# EAGLE design Grove - Themocouple Amplifier (MAX31850K) (EAGLE 6.4)

## Sheet 1 of 2
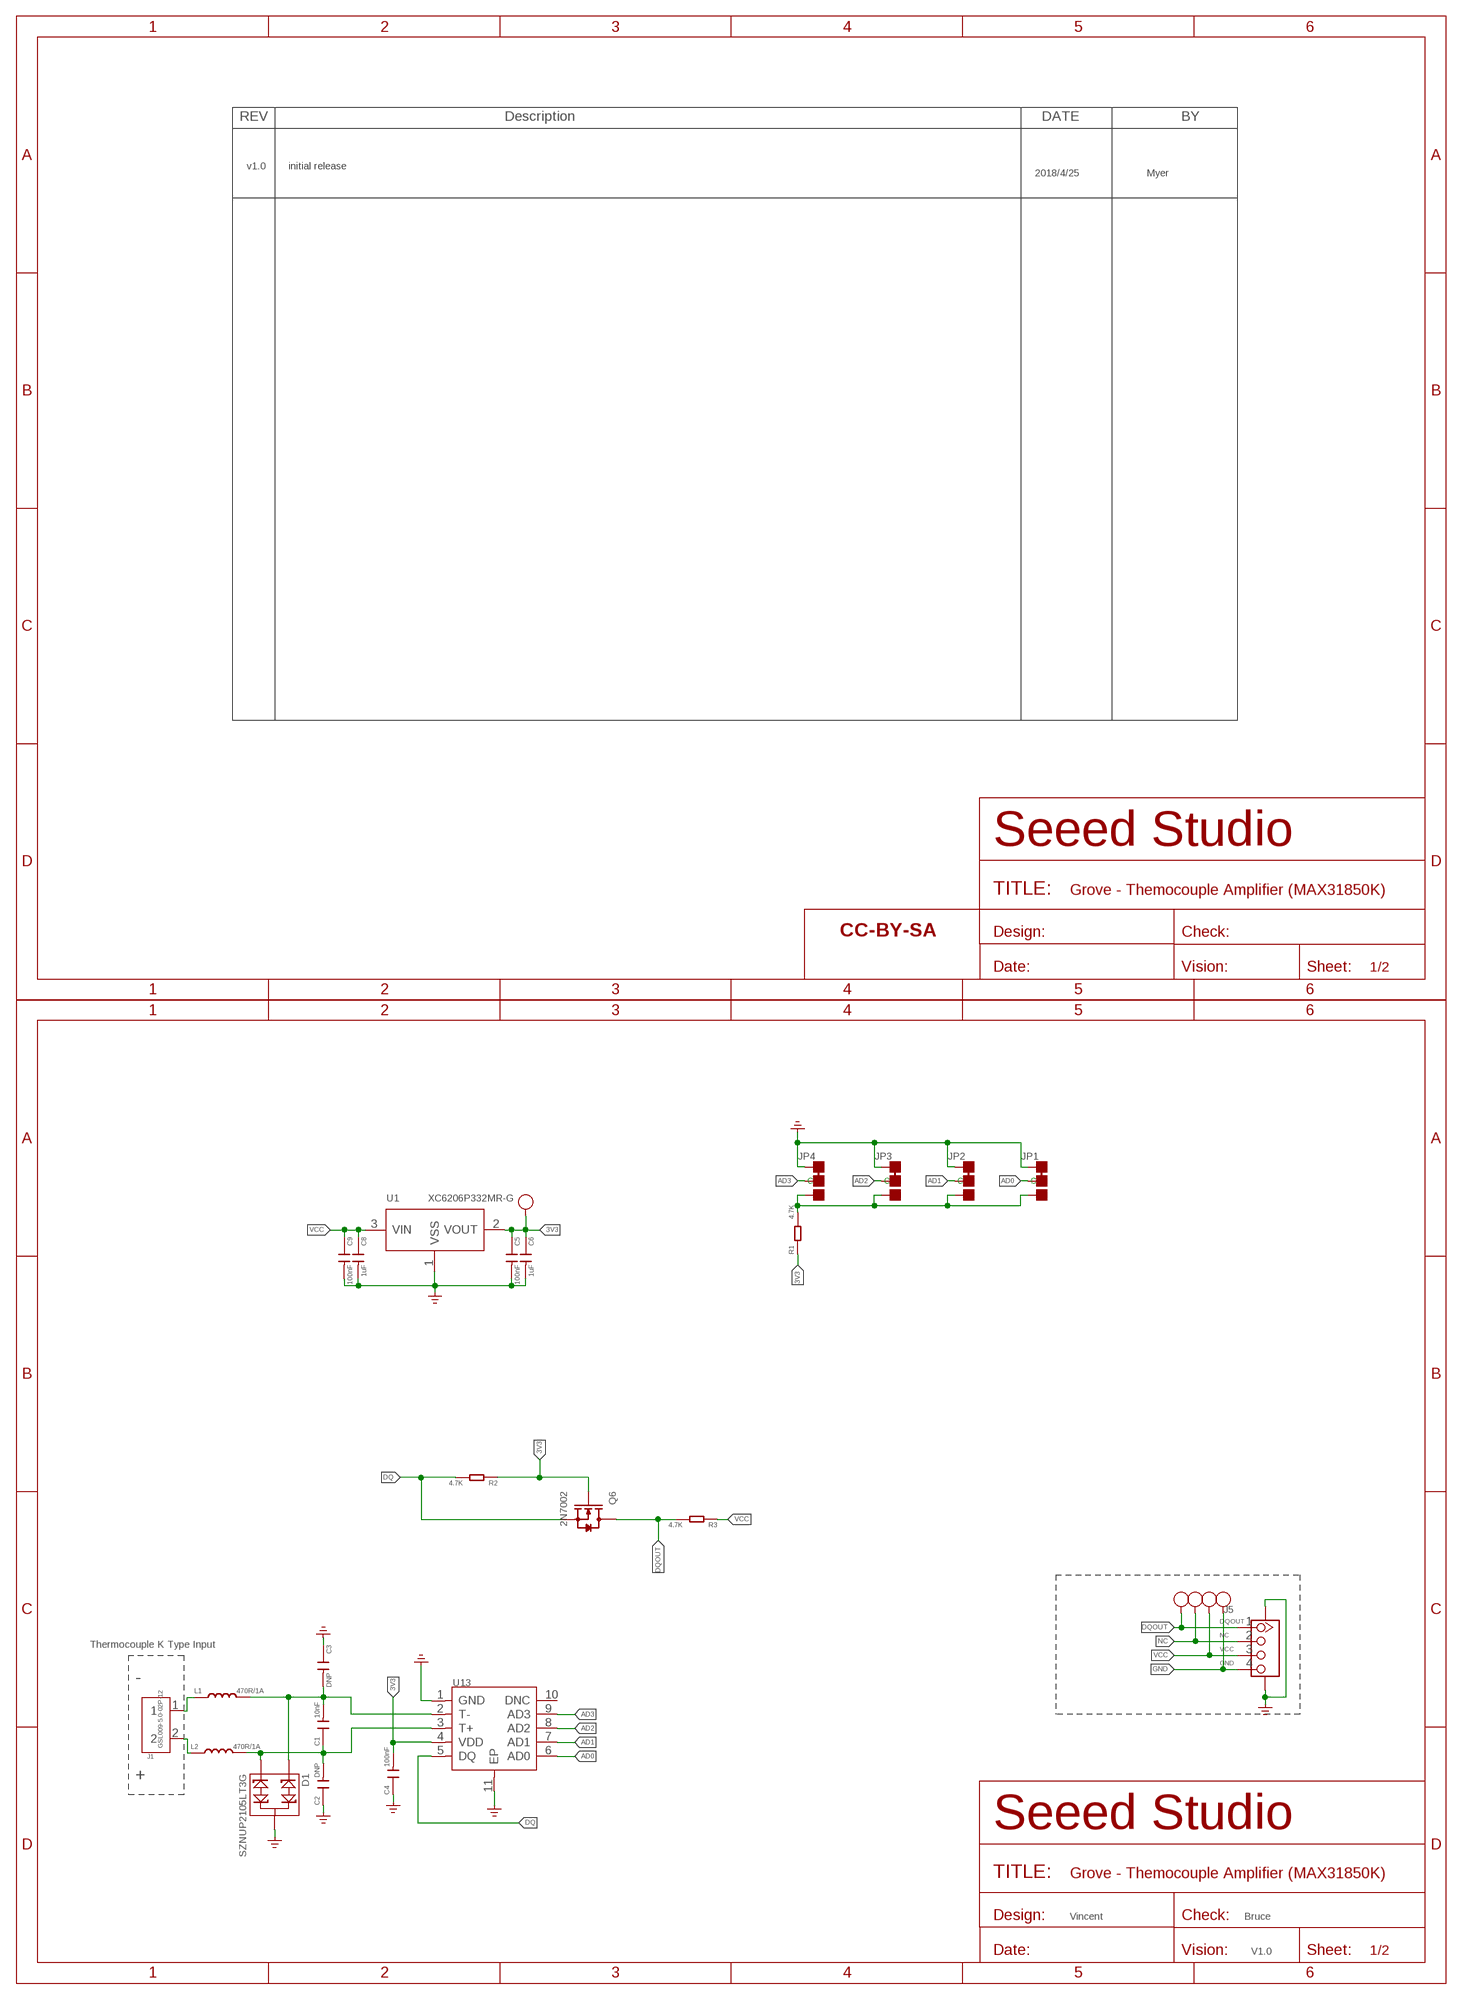
[diagram p0: schematic, sheet 1]

### Parts
C1  10nF  C-0805  [C0805]
C2  DNP  C-0603  [C0603]
C3  DNP  C-0603  [C0603]
C4  100nF  C-0603  [C0603]
C5  100nF  C-0603  [C0603]
C6  1uF  C-0603  [C0603]
C8  1uF  C-0603  [C0603]
C9  100nF  C-0603  [C0603]
D1  SZNUP2105LT3G  D-TVS-3P'PESD5V0L2BT'  [SOT-23]
FR2  SEEEDSTUDIO-OPEN-SCH-FRAME  [SEEEDSTUDIO-PCB-FRAME]
GND4  TEST-POINT'4545'  [TP-D45MIL]
J1  GSL009-5.0-02P-12  SCREW-TERMINAL-2P'5.0-10.6X10X14.8H'  [2P-5.0-10.6X10X14.8H]
J5  GROVE-CONNECTOR-SMD'90D'  [HW4-SMD-2.0-90D]
JP1  JP-3P-SHORT  [3P-SMD-SHORT]
JP2  JP-3P-SHORT  [3P-SMD-SHORT]
JP3  JP-3P-SHORT  [3P-SMD-SHORT]
JP4  JP-3P-SHORT  [3P-SMD-SHORT]
L1  470R/1A  L-0603  [L0603]
L2  470R/1A  L-0603  [L0603]
Q6  2N7002  MOSFET-N+'SI1304BDL'  [SOT-323]
R1  4.7K  R-0603  [R0603]
R2  4.7K  R-0603  [R0603]
R3  4.7K  R-0603  [R0603]
SCL  TEST-POINT'4545'  [TP-D45MIL]
SDA3  TEST-POINT'4545'  [TP-D45MIL]
SDA4  TEST-POINT'4545'  [TP-D45MIL]
U1  XC6206P332MR-G  PMIC-XC6206PMR  [SOT-23]
U13  CONVERTER-MAX31850  [TDFN10-0.5-3X4MM]
VCC1  TEST-POINT'4545'  [TP-D45MIL]

### Nets
3V3: C4.2 C5.1 C6.1 Q6.1(G) R1.1 R2.1 SDA3.T U1.2(VOUT) U13.4(VDD)
AD0: JP1.MM(C) U13.6(AD0)
AD1: JP2.MM(C) U13.7(AD1)
AD2: JP3.MM(C) U13.8(AD2)
AD3: JP4.MM(C) U13.9(AD3)
DQ: Q6.2(S) R2.2 U13.5(DQ)
DQOUT: GND4.T J5.1 Q6.3(D) R3.2
GND: C2.1 C3.1 C4.1 C5.2 C6.2 C8.2 C9.2 D1.3 J5.4 J5.SS1 J5.SS2 JP1.11(L) JP2.11(L) JP3.11(L) JP4.11(L) SCL.T U1.1(VSS) U13.1(GND) U13.11(EP) ; supply symbol labelled GND_POWER
N$1: J1.1 L1.1
N$2: J1.2 L2.1
N$6: JP1.00(R) JP2.00(R) JP3.00(R) JP4.00(R) R1.2
N$8: C1.2 C3.2 D1.1 L1.2 U13.2(T-)
N$9: C1.1 C2.2 D1.2 L2.2 U13.3(T+)
NC: J5.2 VCC1.T
VCC: C8.1 C9.1 J5.3 R3.1 SDA4.T U1.3(VIN)
Unconnected: U13.10(DNC)

### Notes on the sheet
- v1.0 | initial release
- 2018/4/25 | Myer
- Thermocouple K Type Input
- -
- +
- Vincent | Bruce
- V1.0

## Sheet 2 of 2
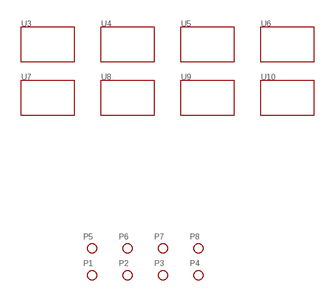
[diagram p1: schematic, sheet 2]

### Parts
P1  PAD-MARK  [ROUND-MARK-1.0]
P2  PAD-MARK  [ROUND-MARK-1.0]
P3  PAD-MARK  [ROUND-MARK-1.0]
P4  PAD-MARK  [ROUND-MARK-1.0]
P5  PAD-MARK  [ROUND-MARK-1.0]
P6  PAD-MARK  [ROUND-MARK-1.0]
P7  PAD-MARK  [ROUND-MARK-1.0]
P8  PAD-MARK  [ROUND-MARK-1.0]
U3  TWIG'2U'  [GROVE-TEST-PLATFORM]
U4  TWIG'2U'  [GROVE-TEST-PLATFORM]
U5  TWIG'2U'  [GROVE-TEST-PLATFORM]
U6  TWIG'2U'  [GROVE-TEST-PLATFORM]
U7  TWIG'2U'  [GROVE-TEST-PLATFORM]
U8  TWIG'2U'  [GROVE-TEST-PLATFORM]
U9  TWIG'2U'  [GROVE-TEST-PLATFORM]
U10  TWIG'2U'  [GROVE-TEST-PLATFORM]

## Library data of the parts
C1-C6 C8 C9 = Discrete-small:C*: Ceramic Capacitors
D1 = Discrete-new:D-TVS-3P: 304050001
FR2 = moudle-new:SEEEDSTUDIO-OPEN-SCH-FRAME
GND4 SCL SDA3 SDA4 VCC1 = Discrete-new:TEST-POINT; PARTNO: DNP
J1 = Connector:SCREW-TERMINAL-2P
J5 = Connector-new:GROVE-CONNECTOR-SMD: 4P-SMD-2.0:320110030;4P-SMD-2.0-90D:320110032
JP1-JP4 = Discrete-new:JP-3P-SHORT
L1 L2 = Discrete-small:L
P1-P8 = Discrete:PAD-MARK; PARTNO: DNP
Q6 = Discrete-new:MOSFET-N+: IRLL014: http://www.vishay.com/docs/91319/sihll014.pdf
R1-R3 = Discrete-small:R*
U1 = IC-new:PMIC-XC6206P: LOW ESR Cap.Compatible Positive Voltage Regulators
U3-U10 = template:TWIG
U13 = IC-new:CONVERTER-MAX31850

## Board
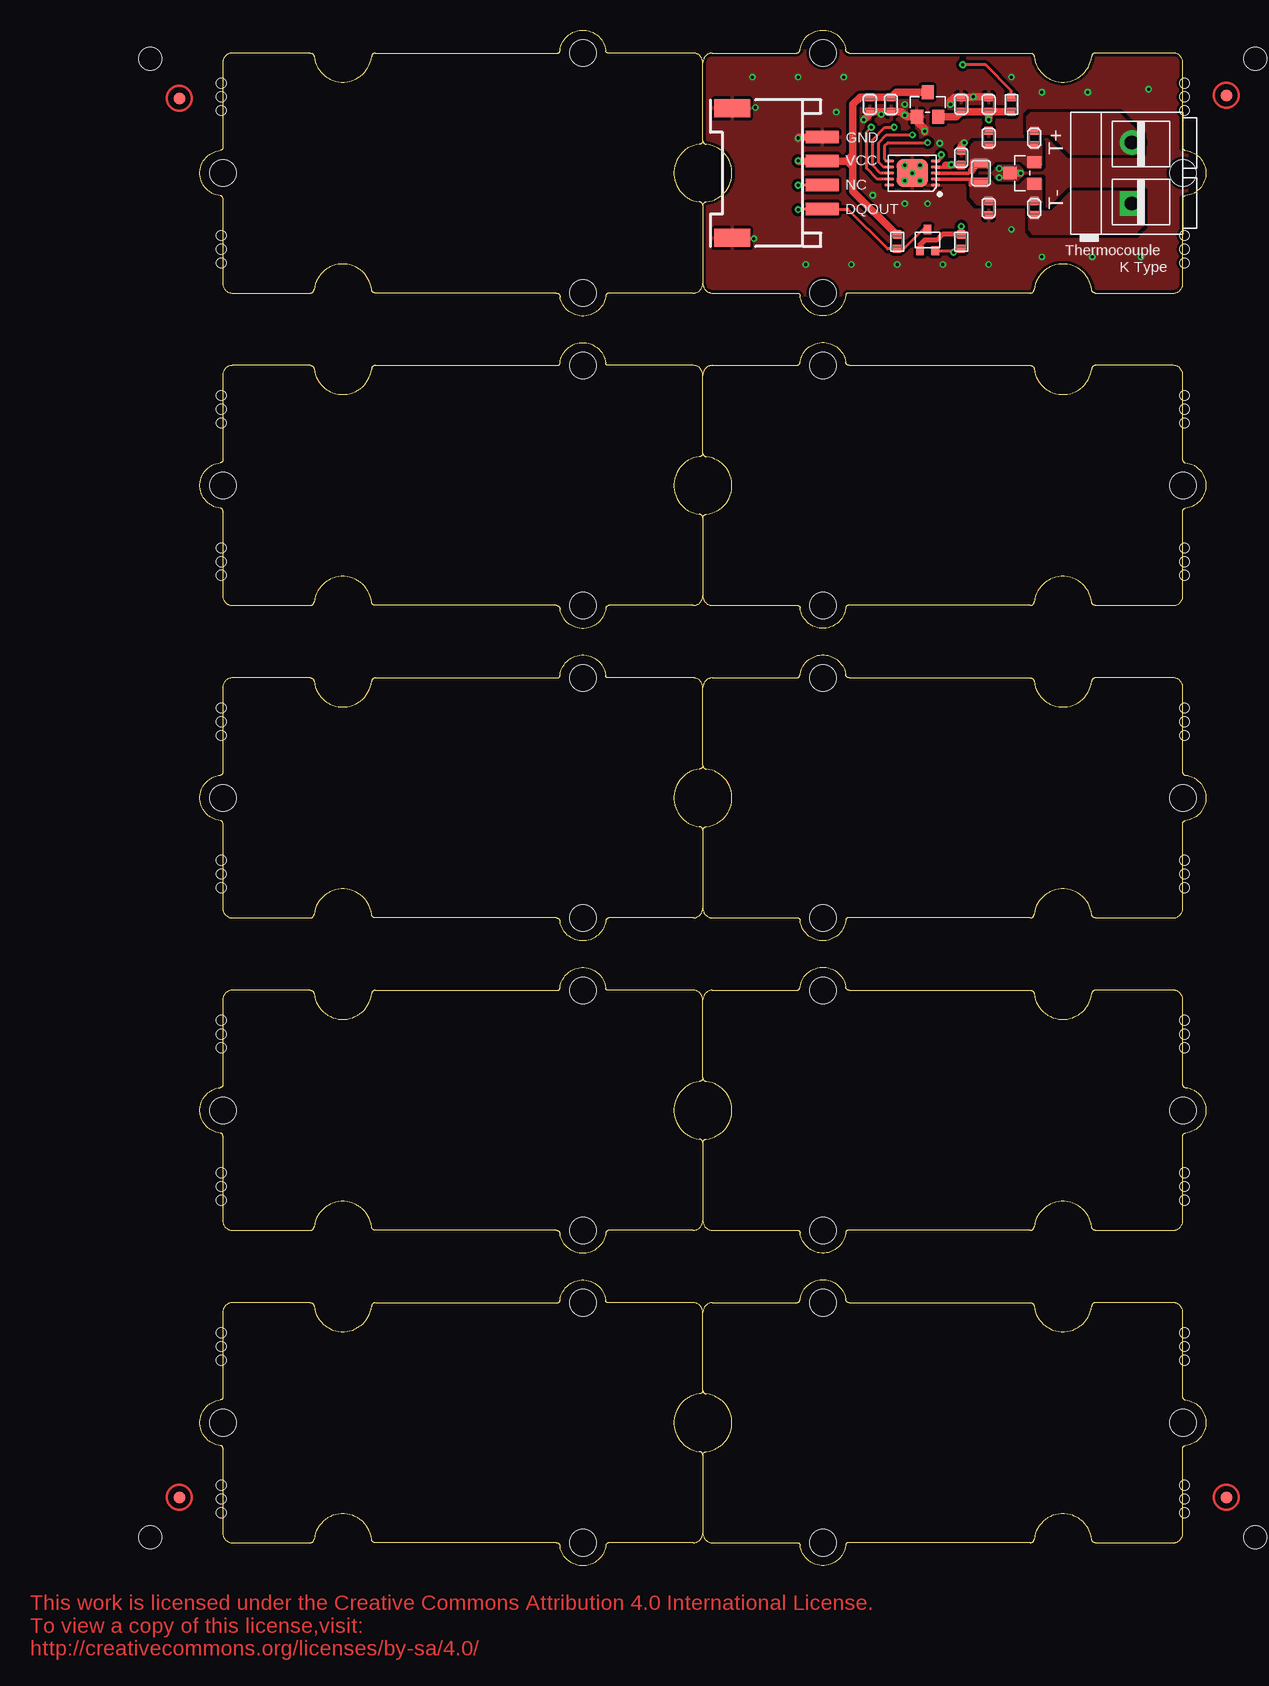
[diagram p2: board, top side]
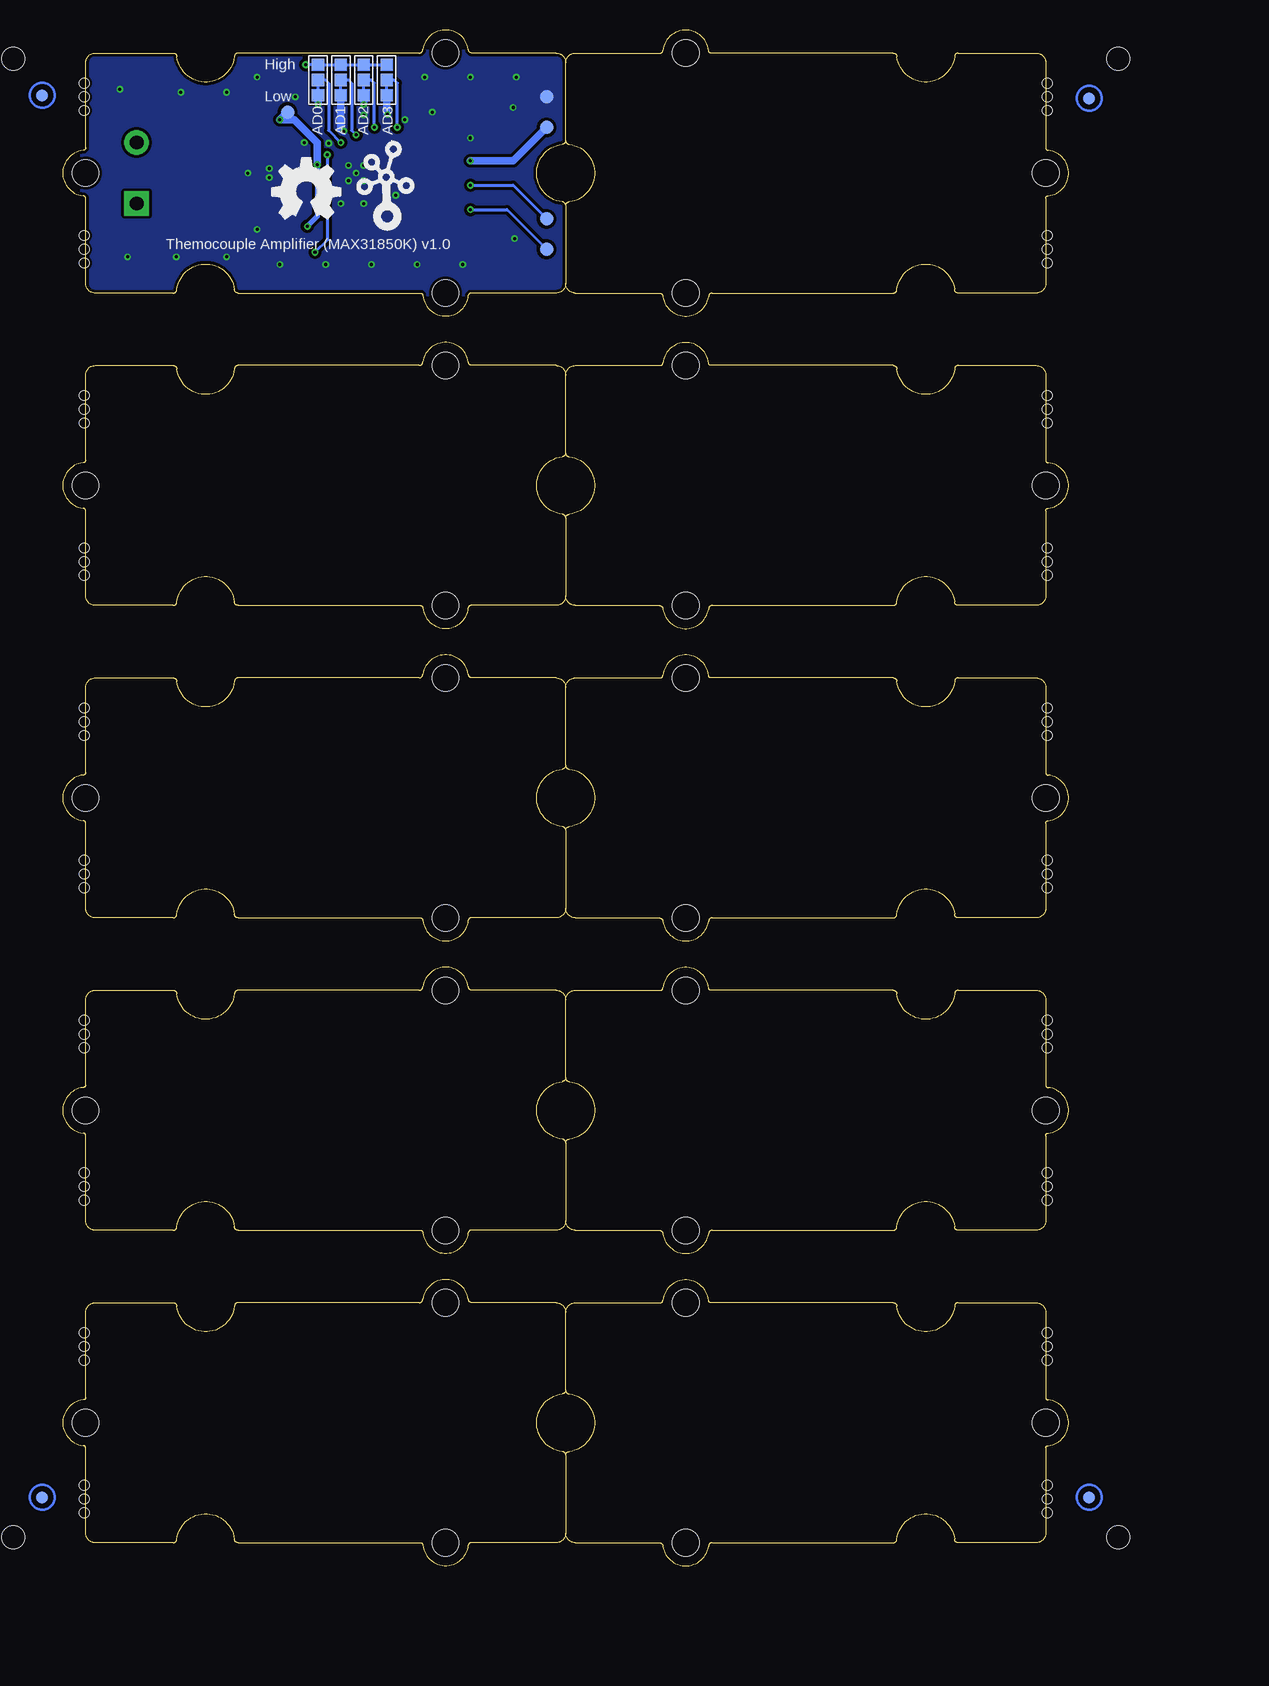
[diagram p3: board, bottom side, seen from below]

Size 83.82 x 127.98 mm. Coordinates in mm from the lower left corner, seen from the top.
Copper layers (1*16): Top 0.035mm / dielectric 1.5mm / Bottom 0.035mm
Design rules "SeeedStudio_2layer_DRU_no_angle_20140221 *": minimum track width 1mil, minimum drill 10mil, track to track 6mil, track to pad 6mil, pad to pad 6mil, via to via 6mil, smd to smd 0mil, copper to edge 10mil, drill to drill 10mil, minimum pad ring 10mil, minimum via ring 6mil, stop-mask expansion 2mil, vias tented up to drill 100mil, thermal gap 10mil
Holes 0.8 mm at 1.78,123.55 1.78,121.27 1.78,122.41 1.78,110.85 1.78,108.57 1.78,109.71 1.78,97.52 1.78,95.23 1.78,96.38 1.78,84.82 1.78,82.53 1.78,83.68 1.78,71.48 1.78,69.2 1.78,70.34 1.78,58.78 1.78,56.5 1.78,57.64 1.78,45.45 1.78,43.16 1.78,44.31 1.78,32.75 1.78,30.46 1.78,31.61 1.78,19.41 1.78,17.13 1.78,18.27 1.78,6.71 1.78,4.43 1.78,5.57 82.04,121.27 82.04,123.55 82.04,122.41 82.04,108.57 82.04,110.85 82.04,109.71 82.04,95.23 82.04,97.52 82.04,96.38 82.04,82.53 82.04,84.82 82.04,83.68 82.04,69.2 82.04,71.48 82.04,70.34 82.04,56.5 82.04,58.78 82.04,57.64 82.04,43.16 82.04,45.45 82.04,44.31 82.04,30.46 82.04,32.75 82.04,31.61 82.04,17.13 82.04,19.41 82.04,18.27 82.04,4.43 82.04,6.71 82.04,5.57
Holes 1.91 mm at -4.13,2.4 87.95,2.4 87.95,125.59 -4.13,125.59

### Footprints (pad centres in the part's own frame; a part is rotated, then mirrored left to right if it is on the bottom)
C0805 = smd 0.819 x 1.27: 1 -0.79,0; 2 0.79,0
C0603 = smd 0.762 x 0.696: 1 0,0.602; 2 0,-0.602
SOT-23 = smd 1.143 x 1.016: 1 1.016,-0.889; 2 1.016,0.889; 3 -1.016,0
TP-D45MIL = smd 1.143 x 1.143: T 0,0
2P-5.0-10.6X10X14.8H = drill 1.143 pad 2.032 square: 1 -2.54,-0.508 | drill 1.143 pad 2.032: 2 2.54,-0.508
HW4-SMD-2.0-90D = smd 1.01 x 2.74: 1 -3,-0.1; 2 -1,-0.1; 3 1,-0.1; 4 3,-0.1 | smd 1.5 x 3: SS1 -5.4,7.4; SS2 5.4,7.4
3P-SMD-SHORT = smd 1.016 x 1.016: 00 -1.27,0; 11 1.27,0; MM 0,0
L0603 = smd 0.762 x 0.696: 1 0,0.602; 2 0,-0.602
ROUND-MARK-1.0 = smd 1.016 x 1.016: P$1 0,0
SOT-323 = smd 0.635 x 0.762: 1 -0.635,-0.889; 2 0.635,-0.889; 3 0,0.889
R0603 = smd 0.762 x 0.696: 1 0,0.602; 2 0,-0.602
SOT-23' = smd 1.016 x 1.143: 1 -0.889,-1.016; 2 0.889,-1.016; 3 0,1.016
GROVE-TEST-PLATFORM = hole 2.2: -10,-10; -10,10; 20,0
GROVE-TEST-PLATFORM@1 = hole 2.2: -10,-10; -10,10; 20,0
TDFN10-0.5-3X4MM = smd 0.79 x 0.28: 1 -1.92,1; 2 -1.92,0.5; 3 -1.92,0; 4 -1.92,-0.5; 5 -1.92,-1; 6 1.92,-1; 7 1.92,-0.5; 8 1.92,0; 9 1.92,0.5; 10 1.92,1 | smd 2.6 x 2.3: 11 0,0

### Placement (x,y rotation side)
C1  65.09,116.06 270 top
C2  65.72,118.98 0 top
C3  65.72,113.14 180 top
C4  63.44,117.33 0 top
C5  65.72,121.78 180 top
C6  63.44,121.78 180 top
C8  55.82,121.78 0 top
C9  57.6,121.78 0 top
D1  68.52,116.06 0 top
FR2  -14.16,-7.51 0 top  (outside the outline)
GND4  43.5,109.71 0 bottom
J1  77.15,116.06 90 top
J5  51.75,116.06 90 top
JP1  62.55,123.81 270 bottom
JP2  60.64,123.81 270 bottom
JP3  58.74,123.81 270 bottom
JP4  56.83,123.81 270 bottom
L1  69.53,113.14 180 top
L2  69.53,118.98 0 top
P1  -1.71,5.7 0 top
P2  85.54,5.7 0 top
P3  -1.71,122.28 0 top
P4  85.54,122.54 0 top
P5  -1.71,5.7 0 bottom
P6  85.54,5.7 0 bottom
P7  85.54,122.54 0 bottom
P8  -1.71,122.28 0 bottom
Q6  60.64,110.47 0 top
R1  67.63,121.78 180 top
R2  63.44,110.35 0 top
R3  58.1,110.35 0 top
SCL  43.5,122.41 0 bottom
SDA3  65.09,121.14 0 bottom
SDA4  43.5,119.87 0 bottom
U1  XC6206P332MR-G  [SOT-23']  60.64,121.78 0 top
U3  61.91,37.96 0 top
U4  21.91,37.96 180 top
U5  61.91,63.99 0 top
U6  21.91,63.99 180 top
U7  61.91,90.03 0 top
U8  21.91,90.03 180 top
U9  21.91,116.06 180 top
U10  61.91,116.06 0 top
U11  [GROVE-TEST-PLATFORM@1]  61.91,11.92 0 top
U12  [GROVE-TEST-PLATFORM@1]  21.91,11.92 180 top
U13  59.37,116.06 180 top
U$2  [GROVE-SILK-BIG]  56.84,112.25 0 bottom
U$5  [OSHW_FILLX200_NOTEXT]  66.36,112.25 0 bottom
VCC1  43.5,112.25 0 bottom

### Tracks (layer width: path | path; a pad name or v marks a point on that pad's centre or on a via)
3V3  (via drill 0.25 pad 0.51)
  Top 0.279: U13.4 62.03,116.56 62.17,116.7
  Top 0.406: Q6.1 60.01,110.09 60.39,110.47 61.41,110.47 61.88,110.95 R2.1 v63.44,111.62
  Top 0.61: U1.2 63.02,120.76 C6.1 C5.1 65.72,121.14 | 65.72,121.14 v65.72,120.51 | R1.1 65.76,121.17 65.72,121.14 | 62.17,116.7 62.2,116.73 62.58,116.73 v62.61,116.76 63.41,116.76 C4.2
  Bottom 0.406: v62.61,116.76 62.61,112.44 v63.44,111.62
  Bottom 0.61: SDA3.T v65.72,120.51 64.54,120.51 62.61,118.58 v62.61,116.76
AD0  (via drill 0.25 pad 0.51)
  Top 0.254: U13.6 57.23,117.06 57.09,117.2 57.09,118.35 57.34,118.6 v60.64,118.6
  Bottom 0.254: JP1.MM 61.91,123.81 61.66,123.55 61.66,119.62 v60.64,118.6
AD1  (via drill 0.25 pad 0.51)
  Top 0.254: U13.7 56.97,116.56 56.58,116.95 56.58,118.6 57.21,119.24 v59.37,119.24
  Bottom 0.254: JP2.MM 60.01,123.81 59.75,123.55 59.75,119.62 v59.37,119.24
AD2  (via drill 0.25 pad 0.51)
  Top 0.254: U13.8 56.71,116.06 56.07,116.7 56.07,118.86 57.09,119.87 v57.85,119.87
  Bottom 0.254: v57.85,119.87 57.85,123.55 58.1,123.81 JP3.MM
AD3  (via drill 0.25 pad 0.51)
  Top 0.254: U13.9 56.44,115.56 55.56,116.44 55.56,119.49 v55.94,119.87
  Bottom 0.254: v55.94,119.87 55.94,123.55 56.2,123.81 JP4.MM
DQ  (via drill 0.25 pad 0.51)
  Top 0.254: U13.5 61.52,117.06 61.79,117.33 v61.79,117.59 | R2.2 63.09,109.74 v62.8,109.46 62.68,109.58 Q6.2
  Bottom 0.254: v61.79,117.59 61.79,110.47 v62.8,109.46
DQOUT  (via drill 0.25 pad 0.51)
  Top 0.254: v49.85,113.01 49.9,113.06 J5.1 53.99,113.06 57.31,109.74 R3.2 58.64,109.74 60.26,111.36 Q6.3
  Bottom 0.254: v49.85,113.01 46.8,113.01 GND4.T
GND  (via drill 0.25 pad 0.51)
  Top 0.61: D1.3 v68.39,116.06 | v62.55,121.78 62.55,122.03 62.9,122.38 C6.2 64.42,122.38 v64.45,122.41 65.69,122.41 C5.2 | J5.4 49.93,119.06 v49.85,118.98 | v55.31,120.51 55.82,121.01 C8.2 C9.2 58.45,121.17 v58.74,120.89 58.87,120.89 58.99,120.76 U1.1 59.75,120.38 60.39,119.74 v60.39,119.55 60.39,119.49 | C4.1 63.44,118.35 v63.69,118.6
  Bottom 0.61: JP1.11 v62.55,121.78 | JP4.11 56.83,121.01 v56.77,120.95 | JP3.11 v58.74,121.78 | JP2.11 60.64,119.81 v60.39,119.55
  other vias: 59.37,116.06 60.01,116.7 58.74,116.7 58.74,115.43 60.01,115.43 58.74,113.52 60.64,113.52 49.85,124.06 46.04,124.06 53.66,124.06 67.63,124.06 70.17,122.79 73.98,122.79 67.63,111.36 65.72,108.44 61.91,108.44 58.1,108.44 54.29,108.44 50.48,108.44 56.07,114.22 53.02,121.14 66.61,116.44 66.61,115.68 70.17,109.08 74.36,109.08 79.06,123.05 78.42,109.08 61.66,118.54 46.29,121.52 46.17,110.6
  pour Bottom (isolate 0.254, rank 6): 41.59,126.22 82.23,126.22 82.23,105.9 41.59,105.9
  pour Top (isolate 0.254, rank 6): 41.59,126.22 82.23,126.22 82.23,105.9 41.59,105.9
  pour Top (isolate 0.254, no thermals): 67.76,116.7 66.52,116.7 66.23,116.41 66.23,115.68 66.49,115.43 68.14,115.43 68.64,115.93 68.64,116.32 68.26,116.7
N$1
  pour Top (isolate 0.254, no thermals): 77.15,114.54 72.58,114.54 70.93,112.89 69.15,112.89 69.03,112.76 69.03,111.36 69.41,110.98 77.92,110.98 78.68,111.74 78.68,114.41 78.55,114.54
N$2
  pour Top (isolate 0.254, no thermals): 78.3,117.59 72.58,117.59 70.93,119.24 69.15,119.24 68.9,119.49 68.9,120.76 69.28,121.14 76.52,121.14 78.55,119.11 78.55,117.84
N$6  (via drill 0.25 pad 0.51)
  Top 0.254: R1.2 67.63,122.92 65.47,125.08 v63.56,125.08
  Bottom 0.254: JP4.00 JP3.00 JP2.00 JP1.00 v63.56,125.08
N$8
  Top 0.279: U13.2 63.73,115.56 64.06,115.56 | 64.06,115.56 64.2,115.43 | 64.33,115.43 64.2,115.43 | 64.2,115.43 64.2,115.05 | 64.06,115.56 64.57,115.56 64.83,115.3
  pour Top (isolate 0.254, no thermals): 69.91,113.39 64.83,113.39 64.2,114.03 64.2,115.43 64.45,115.68 65.72,115.68 66.32,115.09 68.3,115.09 68.9,115.68 70.04,115.68 70.17,115.55 70.17,113.65
N$9
  Top 0.279: U13.3 64.07,116.06 64.33,116.32
  Top 0.61: 64.33,116.32 64.45,116.44 64.45,116.95
  pour Top (isolate 0.254, no thermals): 64.58,118.73 69.91,118.73 70.17,118.47 70.17,116.7 69.91,116.44 69.03,116.44 68.46,117.01 66.29,117.01 65.72,116.44 64.58,116.44 64.2,116.82 64.2,118.35
NC  (via drill 0.25 pad 0.51)
  Top 0.254: J5.2 49.86,115.06 v49.85,115.05
  Bottom 0.254: v49.85,115.05 46.29,115.05 VCC1.T
VCC  (via drill 0.25 pad 0.51)
  Top 0.61: U1.3 58.01,122.79 C9.1 C8.1 55.02,122.38 54.42,121.78 54.42,117.59 | 54.42,117.59 54.42,116.95 | 54.42,116.95 54.42,116.57 | 54.42,116.57 54.42,114.54 58.01,110.95 R3.1 | 53.9,117.06 54.31,117.06 54.42,116.95 | v49.85,117.08 49.86,117.06 J5.3 53.65,117.06 53.9,117.06 | 53.9,117.06 54.42,117.59 | 53.9,117.06 53.93,117.06 54.42,116.57
  Bottom 0.61: v49.85,117.08 46.29,117.08 SDA4.T

### Text on the board
tPlace: GND | T+ | VCC | NC | DQOUT | T- | Thermocouple | K Type
bPlace: High | Low | AD3 | AD2 | AD1 | AD0 | Themocouple Amplifier (MAX31850K) v1.0